# Altium schematic sheet e-stop.SchDoc
size A4
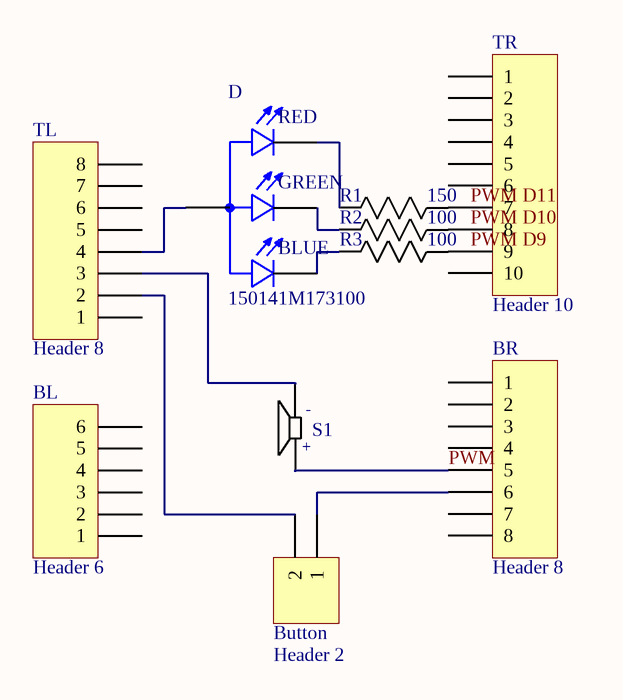
[diagram p0: e-stop.SchDoc]

## Parts
BL  Header 6  [HDR1X6]
BR  Header 8  [HDR1X8]
Button  Header 2  [HDR1X2]
D  150141M173100  [LED_150141M173100]
R1  150  [0805]
R2  100  [0805]
R3  100  [0805]
S1  BUZZER CEM-1203  [CEM-1203]  (value not drawn)
TL  Header 8  [HDR1X8]
TR  Header 10  [HDR1X10]

## Nets
PWM: BR.5 S1.P
NetBR_6: BR.6 Button.1
NetButton_2: Button.2 TL.2
NetD_1: D.1(A) TL.4
NetD_2: D.2(B_C) R3.2(R2)
NetD_3: D.3(R_C) R1.2(R2)
NetD_4: D.4(G_C) R2.2(R2)
NetR1_1: R1.1(R1) TR.7
NetR2_1: R2.1(R1) TR.8
NetR3_1: R3.1(R1) TR.9
NetS1_N: S1.N TL.3

Not connected (* = marked no-connect by the designer): BL 1 2 3 4 5 6; BR 1 2 3 4 7 8; TL 1 5 6 7 8; TR 1 2 3 4 5 6 10

## Notes on the sheet
- Labels drawn without touching a wire or pin: PWM D9, PWM D10, PWM D11
- (in symbol 150141M173100) RED; GREEN; BLUE
- (in symbol BUZZER CEM-1203) -; +

## Library data of the parts
BL = Header 6: Header, 6-Pin; LatestRevisionDate: 17-Jul-2002; LatestRevisionNote: Re-released for DXP Platform.; Publisher: Altium Limited
BR TL = Header 8: Header, 8-Pin; LatestRevisionDate: 17-Jul-2002; LatestRevisionNote: Re-released for DXP Platform.; Publisher: Altium Limited
Button = Header 2: Header, 2-Pin; LatestRevisionDate: 17-Jul-2002; LatestRevisionNote: Re-released for DXP Platform.; Publisher: Altium Limited
D = 150141M173100: Red, Green, Blue _RGB_ 625nm Red, 520nm Green, 470nm Blue LED Indication - Discrete 2V Red, 3.2V Green, 3.2V Blue 1411 _3528 Metric_; MF: Wurth Electronics; SnapEDA_Link: https://www.snapeda.com/parts/150141M173100/Wurth%20Electronics%20Inc./view-part/281733/?ref=snap; Price: None; MP: 150141M173100; Package: 1411 WÃ¼rth Elektronik; Value: *; Availability: Unavailable
R1 = RES 150.0 1/8W: RES SMD 150 OHM 5% 1/8W 0805; Power (Watts): 0.125W; Package: 0805; Value: 150; Tolerance: 5%
R2 R3 = RES 100.0 1/8W: RES SMD 100 OHM 5% 1/8W 0805; Power (Watts): 0.125W; Package: 0805; Value: 100; Tolerance: 5%
S1 = BUZZER CEM-1203: AUDIO MAGNETIC XDCR 3-5V TH; Current Rating: 35 mA @ 3.5 V; Frequency: 2.048 kHz @ 3.5 V; Decibels: 85 dB @ 3.5 V; ComponentLink1Description: Digikey Link; ComponentLink1URL: https://www.digikey.ca/products/en?keywords=CEM%201203%20buzzer; ComponentLink2Description: SnapEDA Link; ComponentLink2URL: https://www.snapeda.com/parts/CEM-1203%2842%29/CUI%20Devices/view-part/?ref=search&t=CEM%201203; Part Name: CEM-1203; Rated Voltage: 3-5 V; Supplier 1: Digi-Key; Supplier Part Number 1: 102-1153-ND
TR = Header 10: Header, 10-Pin; LatestRevisionDate: 17-Jul-2002; LatestRevisionNote: Re-released for DXP Platform.; Publisher: Altium Limited